# EasyEDA schematic circuit_EDA.json
TITLE: Sheet_1; REV: 1.0; Date: 2024-12-24; Sheet: 1/1; Drawn By: mariusinv; Company: Your Company
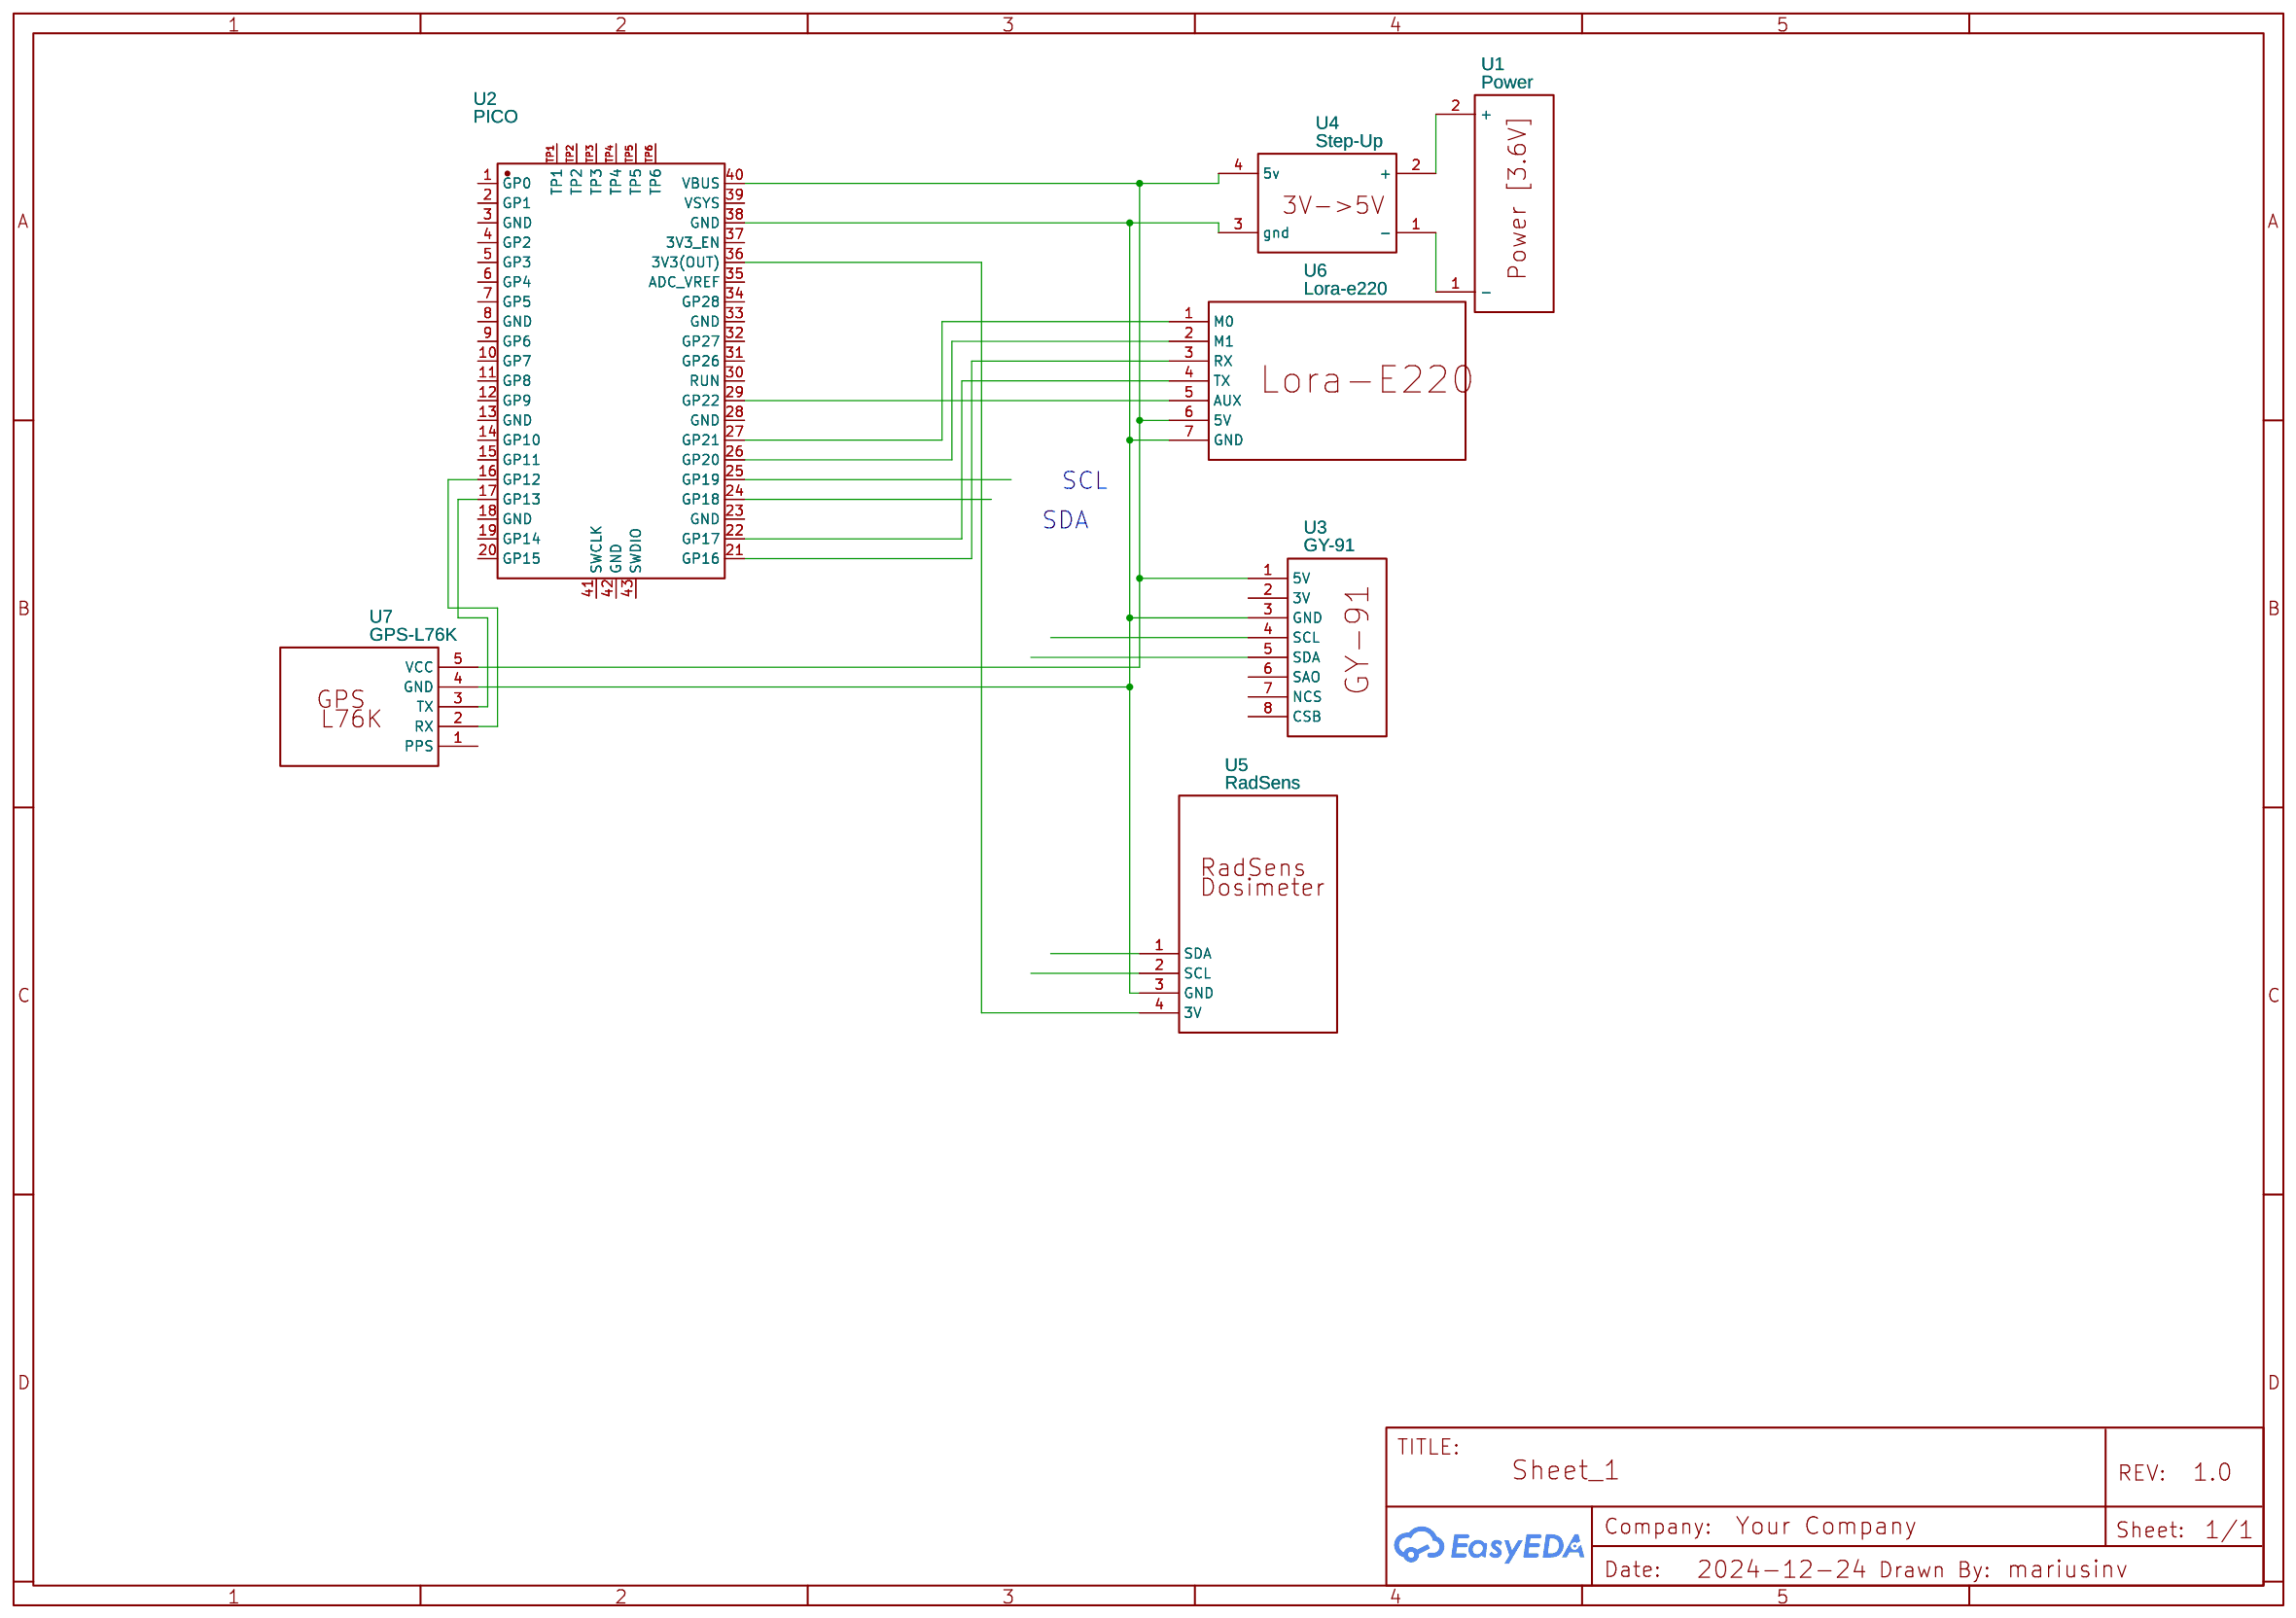
[diagram p0: schematic sheet]

## Parts
U1  Power
U2  PICO  [COMM-SMD_L51.0-W21.0-P2.54_SC0916]
U3  GY-91
U4  Step-Up
U5  RadSens
U6  Lora-e220
U7  GPS-L76K

## Library data of the parts
U1 = Power: Contributor: mariusinv
U2 = PICO: Supplier: LCSC; Supplier Part: C7203002; Manufacturer: Raspberry Pi(树莓派); JLCPCB Part Class: Extended Part; Contributor: lcsc
U3 = GY-91: Contributor: mariusinv
U4 = Step-Up: Contributor: mariusinv
U5 = RadSens: Contributor: mariusinv
U6 = Lora-e220: Contributor: mariusinv
U7 = GPS-L76K: Contributor: mariusinv

## Nets
Net-(U1-1): U1.1(-) U4.1(-)
Net-(U1-2): U1.2(+) U4.2(+)
Net-(U2-16): U2.16(GP12) U7.2(RX)
Net-(U2-17): U2.17(GP13) U7.3(TX)
Net-(U2-21): U2.21(GP16) U6.3(RX)
Net-(U2-22): U2.22(GP17) U6.4(TX)
Net-(U2-26): U2.26(GP20) U6.2(M1)
Net-(U2-27): U2.27(GP21) U6.1(M0)
Net-(U2-29): U2.29(GP22) U6.5(AUX)
Net-(U2-36): U2.36(3V3(OUT)) U5.4(3V)
Net-(U2-38): U2.38(GND) U3.3(GND) U4.3(gnd) U5.3(GND) U6.7(GND) U7.4(GND)
Net-(U2-40): U2.40(VBUS) U3.1(5V) U4.4(5v) U6.6(5V) U7.5(VCC)

Not connected (* = marked no-connect by the designer): U2 1(GP0) 2(GP1) 3(GND) 4(GP2) 5(GP3) 6(GP4) 7(GP5) 8(GND) 9(GP6) 10(GP7) 11(GP8) 12(GP9) 13(GND) 14(GP10) 15(GP11) 18(GND) 19(GP14) 20(GP15) 23(GND) 24(GP18) 25(GP19) 28(GND) 30(RUN) 31(GP26) 32(GP27) 33(GND) 34(GP28) 35(ADC_VREF) 37(3V3_EN) 39(VSYS) 41(SWCLK) 42(GND) 43(SWDIO) TP1 TP2 TP3 TP4 TP5 TP6; U3 2(3V) 4(SCL) 5(SDA) 6(SAO) 7(NCS) 8(CSB); U5 1(SDA) 2(SCL); U7 1(PPS)

## Notes on the sheet
- SCL
- SDA
